# Altium schematic sheet Alimentations.SchDoc: Power supplies
size A4; Organization: Institut d'Automatisation Industrielle; SheetNumber: 3; SheetTotal: 4; SVN: OUI; CurrentTime: 6; CurrentDate: 5; DocumentFullPathAndName: 8; DocumentName: 9; ModifiedDate: 13; ProjectName: <projet>
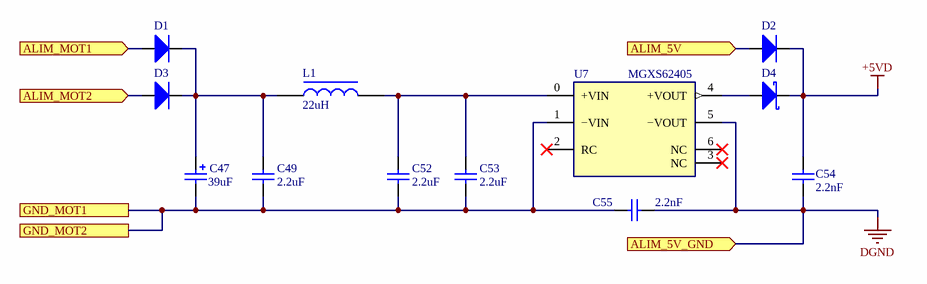
[diagram p0: Alimentations.SchDoc]

## Parts
C47  value 39uF  (hidden comment: CAP ALUM RADIAL)
C49  value 2.2uF  (hidden comment: CAP CER 1203)
C52  value 2.2uF  (hidden comment: CAP CER 1203)
C53  value 2.2uF  (hidden comment: CAP CER 1203)
C54  value 2.2nF  (hidden comment: CAP CER 1812)
C55  value 2.2nF  (hidden comment: CAP CER 1812)
D1  Diode  [SMC]  (value not drawn)
D2  Diode  [SMC]  (value not drawn)
D3  Diode  [SMC]  (value not drawn)
D4  Diode BAT17  [SOT-23_N]  (value not drawn)
L1  value 22uH  (hidden comment: IND SMD 2020)
U7  value MGXS62405  (hidden comment: DC DC CONVERTER 6..60V-5V)

## Ports
ALIM_5V (in), ALIM_5V_GND (in), ALIM_MOT1 (in), ALIM_MOT2 (in), GND_MOT1, GND_MOT2

## Nets
+5VD: C54.2 D2.2(K) D4.3(K)
DGND: C54.1 C55.1 U7.5(−VOUT) ; port ALIM_5V_GND
ALIM_5V: D2.1(A) ; port ALIM_5V
ALIM_MOT1: D1.1(A) ; port ALIM_MOT1
ALIM_MOT2: D3.1(A) ; port ALIM_MOT2
GND_MOT1: C47.2 C49.2 C52.2 C53.2 C55.2 U7.1(−VIN) ; port GND_MOT1, port GND_MOT2
NetC47_1: C47.1 C49.1 D1.2(K) D3.2(K) L1.1
NetC52_1: C52.1 C53.1 L1.2 U7.0(+VIN)
NetD4_1: D4.1(A) U7.4(+VOUT)

Not connected (* = marked no-connect by the designer): U7 2(RC)* 3(NC)* 6(NC)*

## Notes on the sheet
- Title
- Institut d'automatisation industrielle
  rte de Cheseaux 1
  CH-1401 Yverdon-les-Bains
  T +41(0)24 55 77 377    F +41(0)24 55 76 320
  http://iai.heig-vd.ch       iai@heig-vd.ch
- Date:
- Size:
- A4
- Project:
- Sheet
- of
- No.
- Author:
- SVN
- Version
- File:

## Library data of the parts
C47 = CAP ALUM 39uF 20% 100V: Condensateurs électrolytiques aluminium 100V 39µF Radial, boîtier métallique 7000 heures à 105°C; Supplier 1: Digi-Key; Supplier Part Number 1: 493-1662-ND
C49 C52 C53 = CAP CER 2.2uF 10% 100V 1206: 2,2µF ±10% 100V Condensateurs céramique X5R 1206 (3216 métrique); Supplier 1: Digi-Key; Supplier Part Number 1: 1276-2724-1-ND
C54 C55 = CAP CER 2.2nF 10% 2kV 1812: 2.2nF ±10% 2000V (2kV) Condensateurs céramique X7R 1812 (4532 métrique); Supplier 1: Digi-Key; Supplier Part Number 1: 490-6107-1-ND
D1-D3 = Diode: Default Diode; Published: 8-Jun-2000; LatestRevisionDate: 17-Jul-2002; LatestRevisionNote: Re-released for DXP Platform.; PackageVersion: Sep-1996; PackageReference: SMC; Publisher: Altium Limited; PackageDescription: DO-214-AB/SMC; 2 C-Bend Leads; Body 7.9 x 5.9 mm, inc. leads (LxW); Code_JEDEC: DO-214-AB
D4 = Diode BAT17: Silicon RF Schottky Diode for Mixer Applications in the VHF/UHF Range; Note: Pin 2 is not connected and not drawn.; Published: 21-Mar-2003; LatestRevisionDate: 29-May-2009; LatestRevisionNote: IPC-7351 Footprint Added.; DatasheetVersion: Oct-1999; PackageVersion: Sep-2001; PackageReference: SOT-23; Publisher: Altium Limited; PackageDescription: 3-Pin SOT-23 Package 0.95 mm Pitch, 2.5 mm Lead Span; ComponentLink1Description: Manufacturer Link; ComponentLink1URL: http://www.infineon.com/; ComponentLink2Description: Datasheet; ComponentLink2URL: http://www.infineon.com/upload/Document/cmc_upload/documents/009/363/bat17series.pdf
L1 = IND SMD 22uH 1A 0.26OHM: 22µH Blindé Bobiné Inducteur 1,05A 259mOhms Non standard; Supplier 1: Avnet; Supplier Part Number 1: LQH5BPN220MT0L
U7 = DC DC CONVERTER 6..60V-5V 6W: Module isolé Convertisseurs CC/CC 1 Sortie 5V 1,2A 6V - 60V Entrée; Supplier 1: Digi-Key; Supplier Part Number 1: 1776-3669-ND